# Altium project AirGunBoard.PrjPcb
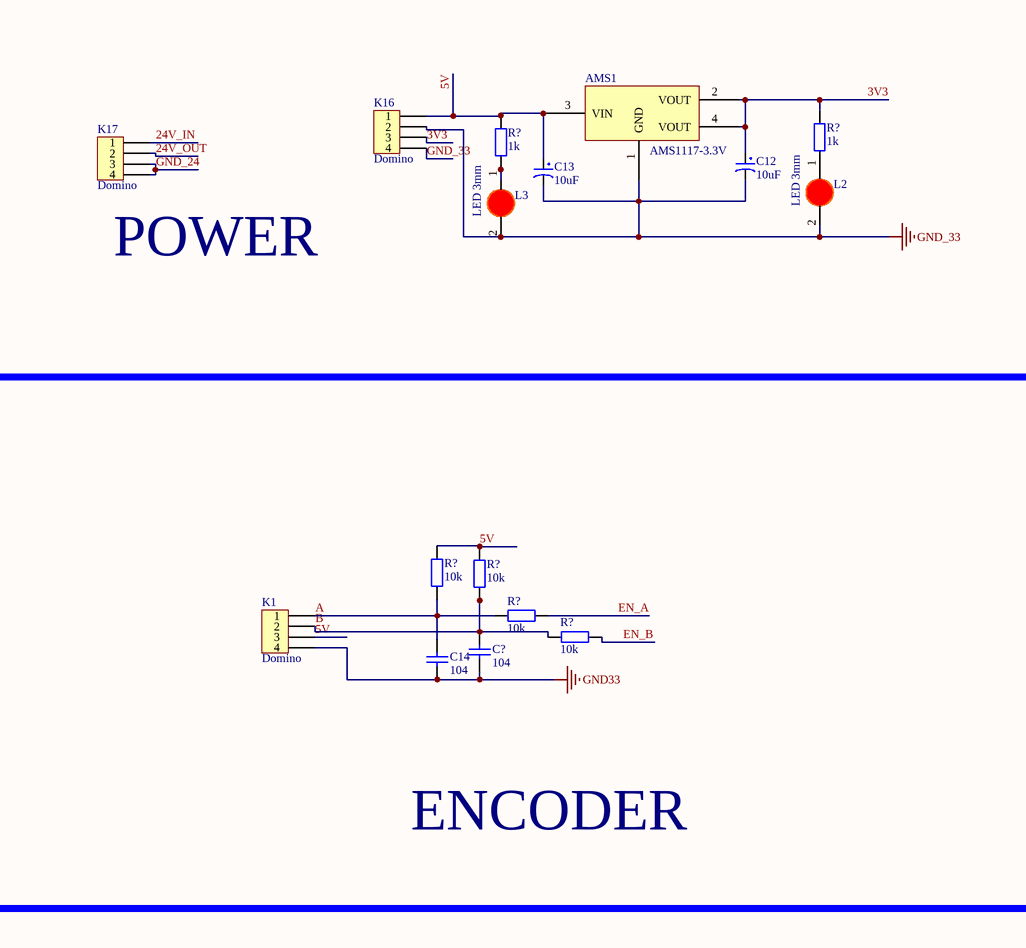
[diagram p0: board.SchDoc, top left]
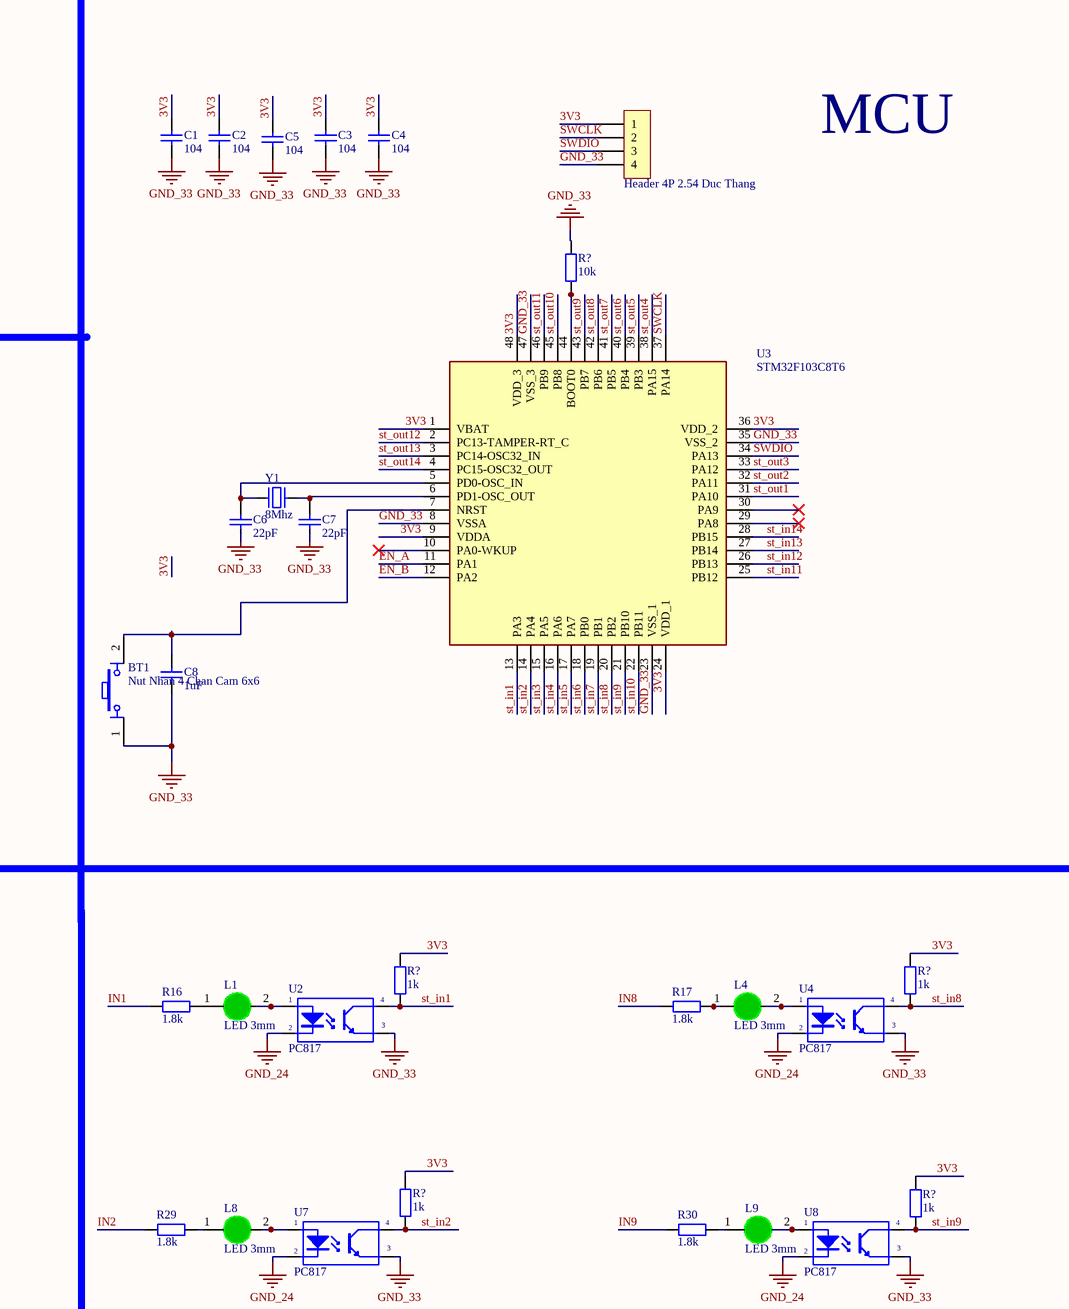
[diagram p1: board.SchDoc, top right]
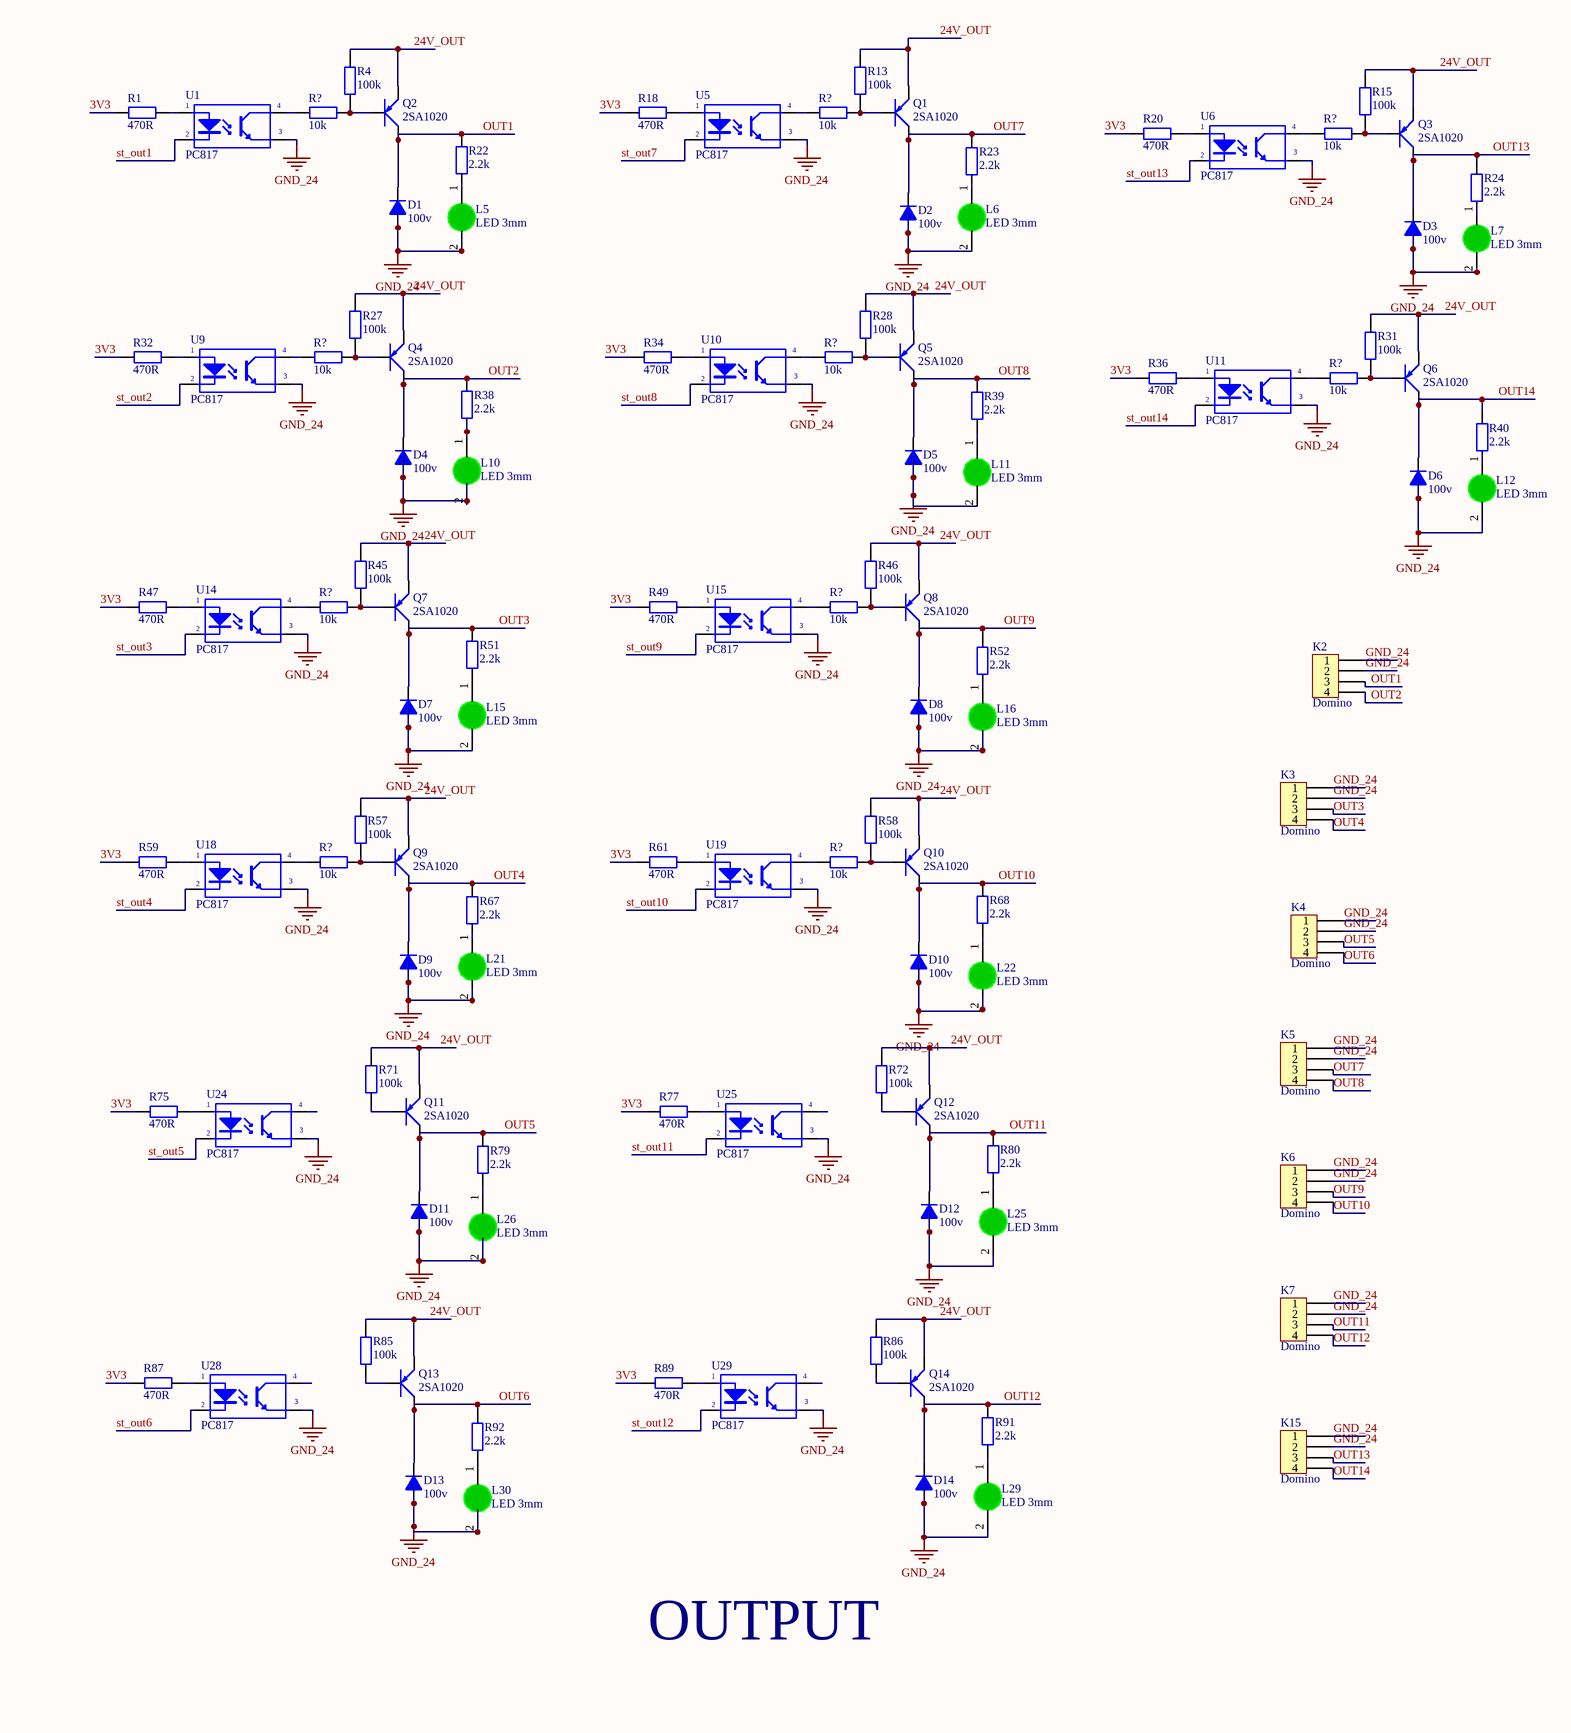
[diagram p2: board.SchDoc, bottom left]
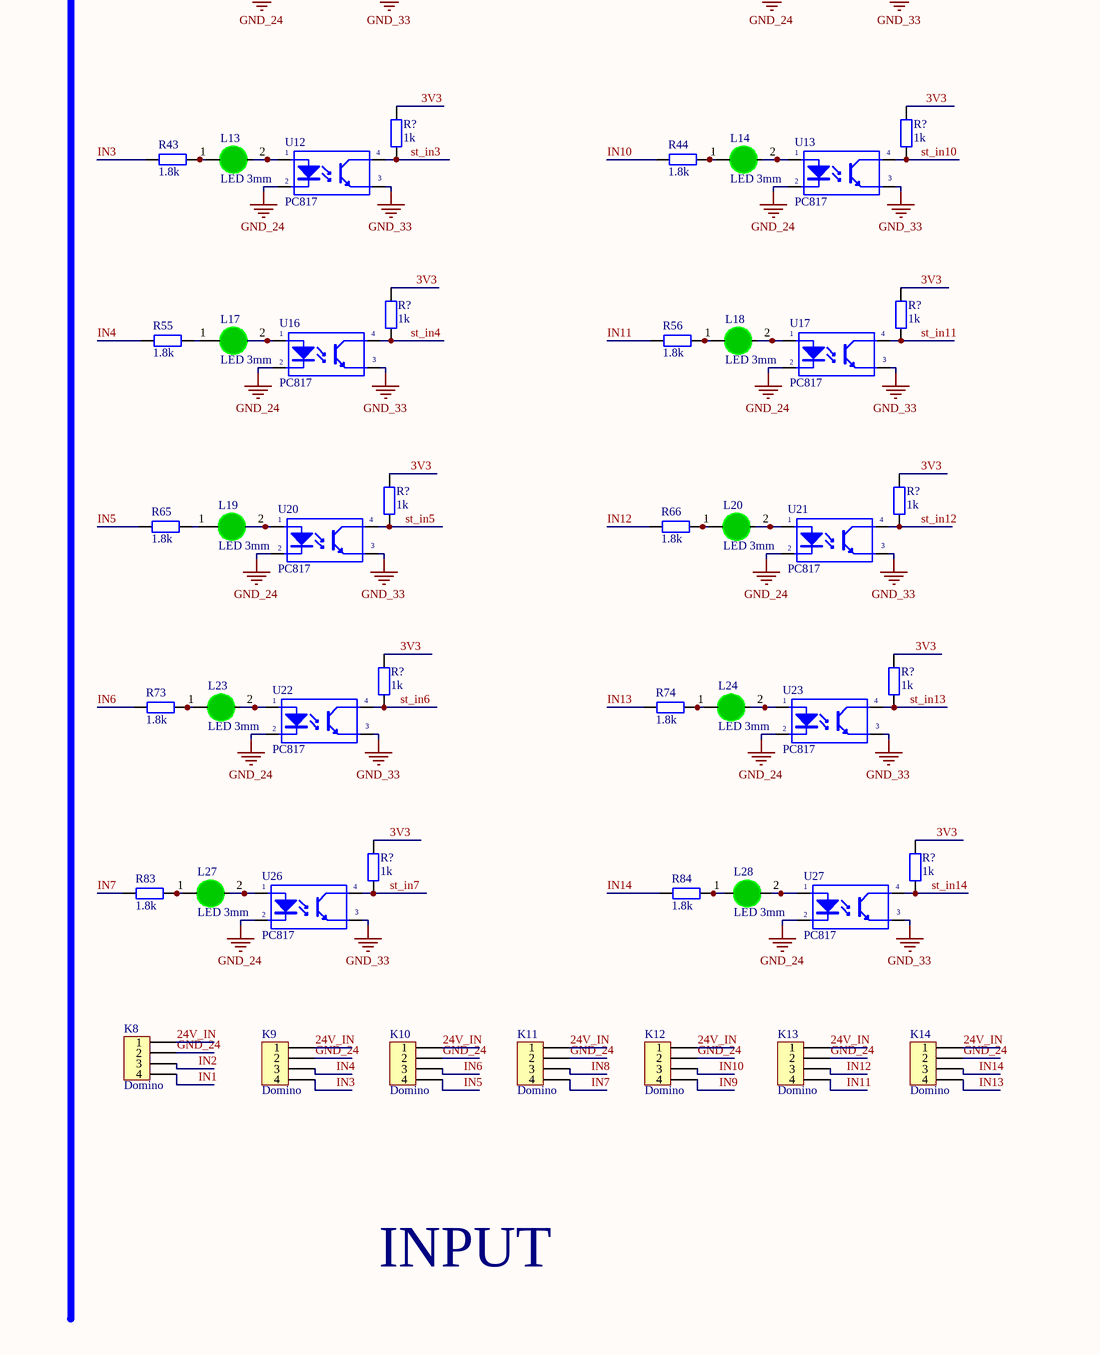
[diagram p3: board.SchDoc, bottom right]
1 sheet, 207 parts. Net scope: global (net labels, ports and power ports of the same name join across sheets).
Board file: board.PcbDoc

## Sheet board.SchDoc
size 500 x 500 mm; SheetNumber: 1; SheetTotal: 1

### Parts
(Parts that share a designator on the sheet are numbered #1, #2 ... from top to bottom, then left to right.)
AMS1  AMS1117-3.3V  [SOT223]
BT1  Nut Nhan 4 Chan Cam 6x6  [Nut Nhan 4 Chan Cam 6x6]
C1  104  [tu gom]
C2  104  [tu gom]
C3  104  [tu gom]
C4  104  [tu gom]
C5  104  [tu gom]
C6  22pF  [tu gom]
C7  22pF  [tu gom]
C8  1uF  [tu tantalum dip5.08]
C12  10uF  [tu hoa 4mm]
C13  10uF  [tu hoa 4mm]
C14  104  [tu gom]
C?  104  [tu 1206]
D1  100v  [DIODE 1A]
D2  100v  [DIODE 1A]
D3  100v  [DIODE 1A]
D4  100v  [DIODE 1A]
D5  100v  [DIODE 1A]
D6  100v  [DIODE 1A]
D7  100v  [DIODE 1A]
D8  100v  [DIODE 1A]
D9  100v  [DIODE 1A]
D10  100v  [DIODE 1A]
D11  100v  [DIODE 1A]
D12  100v  [DIODE 1A]
D13  100v  [DIODE 1A]
D14  100v  [DIODE 1A]
H1  Header 4P 2.54 Duc Thang  [XH2.54M-4]
K1  Domino  [KF128HL_2P]
K2  Domino  [KF128HL_2P]
K3  Domino  [KF128HL_2P]
K4  Domino  [KF128HL_2P]
K5  Domino  [KF128HL_2P]
K6  Domino  [KF128HL_2P]
K7  Domino  [KF128HL_2P]
K8  Domino  [KF128HL_2P]
K9  Domino  [KF128HL_2P]
K10  Domino  [KF128HL_2P]
K11  Domino  [KF128HL_2P]
K12  Domino  [KF128HL_2P]
K13  Domino  [KF128HL_2P]
K14  Domino  [KF128HL_2P]
K15  Domino  [KF128HL_2P]
K16  Domino  [KF128HL_2P]
K17  Domino  [KF128HL_2P]
L1  LED 3mm  [LED-3MM-GREEN]
L2  LED 3mm  [LED-3MM-RED]
L3  LED 3mm  [LED-3MM-RED]
L4  LED 3mm  [LED-3MM-GREEN]
L5  LED 3mm  [LED-3MM-GREEN]
L6  LED 3mm  [LED-3MM-GREEN]
L7  LED 3mm  [LED-3MM-GREEN]
L8  LED 3mm  [LED-3MM-GREEN]
L9  LED 3mm  [LED-3MM-GREEN]
L10  LED 3mm  [LED-3MM-GREEN]
L11  LED 3mm  [LED-3MM-GREEN]
L12  LED 3mm  [LED-3MM-GREEN]
L13  LED 3mm  [LED-3MM-GREEN]
L14  LED 3mm  [LED-3MM-GREEN]
L15  LED 3mm  [LED-3MM-GREEN]
L16  LED 3mm  [LED-3MM-GREEN]
L17  LED 3mm  [LED-3MM-GREEN]
L18  LED 3mm  [LED-3MM-GREEN]
L19  LED 3mm  [LED-3MM-GREEN]
L20  LED 3mm  [LED-3MM-GREEN]
L21  LED 3mm  [LED-3MM-GREEN]
L22  LED 3mm  [LED-3MM-GREEN]
L23  LED 3mm  [LED-3MM-GREEN]
L24  LED 3mm  [LED-3MM-GREEN]
L25  LED 3mm  [LED-3MM-GREEN]
L26  LED 3mm  [LED-3MM-GREEN]
L27  LED 3mm  [LED-3MM-GREEN]
L28  LED 3mm  [LED-3MM-GREEN]
L29  LED 3mm  [LED-3MM-GREEN]
L30  LED 3mm  [LED-3MM-GREEN]
Q1  2SA1020  [TO92-123]
Q2  2SA1020  [TO92-123]
Q3  2SA1020  [TO92-123]
Q4  2SA1020  [TO92-123]
Q5  2SA1020  [TO92-123]
Q6  2SA1020  [TO92-123]
Q7  2SA1020  [TO92-123]
Q8  2SA1020  [TO92-123]
Q9  2SA1020  [TO92-123]
Q10  2SA1020  [TO92-123]
Q11  2SA1020  [TO92-123]
Q12  2SA1020  [TO92-123]
Q13  2SA1020  [TO92-123]
Q14  2SA1020  [TO92-123]
R1  470R  [tro vach 1/4w]
R4  100k  [tro vach 1/4w]
R13  100k  [tro vach 1/4w]
R15  100k  [tro vach 1/4w]
R16  1.8k  [tro vach 1/4w]
R17  1.8k  [tro vach 1/4w]
R18  470R  [tro vach 1/4w]
R20  470R  [tro vach 1/4w]
R22  2.2k  [tro vach 1/4w]
R23  2.2k  [tro vach 1/4w]
R24  2.2k  [tro vach 1/4w]
R27  100k  [tro vach 1/4w]
R28  100k  [tro vach 1/4w]
R29  1.8k  [tro vach 1/4w]
R30  1.8k  [tro vach 1/4w]
R31  100k  [tro vach 1/4w]
R32  470R  [tro vach 1/4w]
R34  470R  [tro vach 1/4w]
R36  470R  [tro vach 1/4w]
R38  2.2k  [tro vach 1/4w]
R39  2.2k  [tro vach 1/4w]
R40  2.2k  [tro vach 1/4w]
R43  1.8k  [tro vach 1/4w]
R44  1.8k  [tro vach 1/4w]
R45  100k  [tro vach 1/4w]
R46  100k  [tro vach 1/4w]
R47  470R  [tro vach 1/4w]
R49  470R  [tro vach 1/4w]
R51  2.2k  [tro vach 1/4w]
R52  2.2k  [tro vach 1/4w]
R55  1.8k  [tro vach 1/4w]
R56  1.8k  [tro vach 1/4w]
R57  100k  [tro vach 1/4w]
R58  100k  [tro vach 1/4w]
R59  470R  [tro vach 1/4w]
R61  470R  [tro vach 1/4w]
R65  1.8k  [tro vach 1/4w]
R66  1.8k  [tro vach 1/4w]
R67  2.2k  [tro vach 1/4w]
R68  2.2k  [tro vach 1/4w]
R71  100k  [tro vach 1/4w]
R72  100k  [tro vach 1/4w]
R73  1.8k  [tro vach 1/4w]
R74  1.8k  [tro vach 1/4w]
R75  470R  [tro vach 1/4w]
R77  470R  [tro vach 1/4w]
R79  2.2k  [tro vach 1/4w]
R80  2.2k  [tro vach 1/4w]
R83  1.8k  [tro vach 1/4w]
R84  1.8k  [tro vach 1/4w]
R85  100k  [tro vach 1/4w]
R86  100k  [tro vach 1/4w]
R87  470R  [tro vach 1/4w]
R89  470R  [tro vach 1/4w]
R91  2.2k  [tro vach 1/4w]
R92  2.2k  [tro vach 1/4w]
R?#1  1k  [tro smd 1206]
R?#2  1k  [tro smd 1206]
R?#3  10k  [tro smd 1206]
R?#4  10k  [tro smd 1206]
R?#5  10k  [tro smd 1206]
R?#6  10k  [tro smd 1206]
R?#7  10k  [tro smd 1206]
R?#8  1k  [tro smd 1206]
R?#9  1k  [tro smd 1206]
R?#10  10k  [tro smd 1206]
R?#11  10k  [tro smd 1206]
R?#12  10k  [tro smd 1206]
R?#13  1k  [tro smd 1206]
R?#14  1k  [tro smd 1206]
R?#15  10k  [tro smd 1206]
R?#16  10k  [tro smd 1206]
R?#17  10k  [tro smd 1206]
R?#18  1k  [tro smd 1206]
R?#19  1k  [tro smd 1206]
R?#20  10k  [tro smd 1206]
R?#21  10k  [tro smd 1206]
R?#22  1k  [tro smd 1206]
R?#23  1k  [tro smd 1206]
R?#24  10k  [tro smd 1206]
R?#25  10k  [tro smd 1206]
R?#26  1k  [tro smd 1206]
R?#27  1k  [tro smd 1206]
R?#28  1k  [tro smd 1206]
R?#29  1k  [tro smd 1206]
R?#30  1k  [tro smd 1206]
R?#31  1k  [tro smd 1206]
U1  PC817  [DIP4]
U2  PC817  [DIP4]
U3  STM32F103C8T6  [LQFP-48_19.6_393_58X11_SMD]
U4  PC817  [DIP4]
U5  PC817  [DIP4]
U6  PC817  [DIP4]
U7  PC817  [DIP4]
U8  PC817  [DIP4]
U9  PC817  [DIP4]
U10  PC817  [DIP4]
U11  PC817  [DIP4]
U12  PC817  [DIP4]
U13  PC817  [DIP4]
U14  PC817  [DIP4]
U15  PC817  [DIP4]
U16  PC817  [DIP4]
U17  PC817  [DIP4]
U18  PC817  [DIP4]
U19  PC817  [DIP4]
U20  PC817  [DIP4]
U21  PC817  [DIP4]
U22  PC817  [DIP4]
U23  PC817  [DIP4]
U24  PC817  [DIP4]
U25  PC817  [DIP4]
U26  PC817  [DIP4]
U27  PC817  [DIP4]
U28  PC817  [DIP4]
U29  PC817  [DIP4]
Y1  8Mhz  [Thach Anh 2 chan cam]

### Nets
GND33: C14.2 C?.2 K1.4
GND_24: D1.1(A) D2.1(A) D3.1(A) D4.1(A) D5.1(A) D6.1(A) D7.1(A) D8.1(A) D9.1(A) D10.1(A) D11.1(A) D12.1(A) D13.1(A) D14.1(A) K2.1 K2.2 K3.1 K3.2 K4.1 K4.2 K5.1 K5.2 K6.1 K6.2 K7.1 K7.2 K8.2 K9.2 K10.2 K11.2 K12.2 K13.2 K14.2 K15.1 K15.2 K17.3 K17.4 L5.2(K) L6.2(K) L7.2(K) L10.2(K) L11.2(K) L12.2(K) L15.2(K) L16.2(K) L21.2(K) L22.2(K) L25.2(K) L26.2(K) L29.2(K) L30.2(K) U1.3(E) U2.2(K) U4.2(K) U5.3(E) U6.3(E) U7.2(K) U8.2(K) U9.3(E) U10.3(E) U11.3(E) U12.2(K) U13.2(K) U14.3(E) U15.3(E) U16.2(K) U17.2(K) U18.3(E) U19.3(E) U20.2(K) U21.2(K) U22.2(K) U23.2(K) U24.3(E) U25.3(E) U26.2(K) U27.2(K) U28.3(E) U29.3(E)
GND_33: AMS1.1(GND) BT1.1 C1.2 C2.2 C3.2 C4.2 C5.2 C6.2 C7.2 C8.2 C12.2 C13.2 H1.4 K16.2 K16.4 L2.2(K) L3.2(K) R?#3.2 U2.3(E) U3.8(VSSA) U3.23(VSS_1) U3.35(VSS_2) U3.47(VSS_3) U4.3(E) U7.3(E) U8.3(E) U12.3(E) U13.3(E) U16.3(E) U17.3(E) U20.3(E) U21.3(E) U22.3(E) U23.3(E) U26.3(E) U27.3(E)
3V3: AMS1.2(VOUT) AMS1.4(VOUT) C1.1 C2.1 C3.1 C4.1 C5.1 C12.1 H1.1 K16.3 R1.1 R18.1 R20.1 R32.1 R34.1 R36.1 R47.1 R49.1 R59.1 R61.1 R75.1 R77.1 R87.1 R89.1 R?#1.2 R?#8.2 R?#9.2 R?#13.2 R?#14.2 R?#18.2 R?#19.2 R?#22.2 R?#23.2 R?#26.2 R?#27.2 R?#28.2 R?#29.2 R?#30.2 R?#31.2 U3.1(VBAT) U3.9(VDDA) U3.24(VDD_1) U3.36(VDD_2) U3.48(VDD_3)
5V: AMS1.3(VIN) C13.1 K1.3 K16.1 R?#2.2 R?#4.2 R?#5.2
24V_IN: K8.1 K9.1 K10.1 K11.1 K12.1 K13.1 K14.1 K17.1
24V_OUT: K17.2 Q1.1(E) Q2.1(E) Q3.1(E) Q4.1(E) Q5.1(E) Q6.1(E) Q7.1(E) Q8.1(E) Q9.1(E) Q10.1(E) Q11.1(E) Q12.1(E) Q13.1(E) Q14.1(E) R4.2 R13.2 R15.2 R27.2 R28.2 R31.2 R45.2 R46.2 R57.2 R58.2 R71.2 R72.2 R85.2 R86.2
A: C14.1 K1.1 R?#4.1 R?#6.2
B: C?.1 K1.2 R?#5.1 R?#7.2
EN_A: R?#6.1 U3.11(PA1)
EN_B: R?#7.1 U3.12(PA2)
IN1: K8.4 R16.1
IN2: K8.3 R29.1
IN3: K9.4 R43.1
IN4: K9.3 R55.1
IN5: K10.4 R65.1
IN6: K10.3 R73.1
IN7: K11.4 R83.1
IN8: K11.3 R17.1
IN9: K12.4 R30.1
IN10: K12.3 R44.1
IN11: K13.4 R56.1
IN12: K13.3 R66.1
IN13: K14.4 R74.1
IN14: K14.3 R84.1
OUT1: D1.2(K) K2.3 Q2.2(C) R22.2
OUT2: D4.2(K) K2.4 Q4.2(C) R38.2
OUT3: D7.2(K) K3.3 Q7.2(C) R51.2
OUT4: D9.2(K) K3.4 Q9.2(C) R67.2
OUT5: D11.2(K) K4.3 Q11.2(C) R79.2
OUT6: D13.2(K) K4.4 Q13.2(C) R92.2
OUT7: D2.2(K) K5.3 Q1.2(C) R23.2
OUT8: D5.2(K) K5.4 Q5.2(C) R39.2
OUT9: D8.2(K) K6.3 Q8.2(C) R52.2
OUT10: D10.2(K) K6.4 Q10.2(C) R68.2
OUT11: D12.2(K) K7.3 Q12.2(C) R80.2
OUT12: D14.2(K) K7.4 Q14.2(C) R91.2
OUT13: D3.2(K) K15.3 Q3.2(C) R24.2
OUT14: D6.2(K) K15.4 Q6.2(C) R40.2
st_in1: R?#8.1 U2.4(C) U3.13(PA3)
st_in2: R?#13.1 U3.14(PA4) U7.4(C)
st_in3: R?#18.1 U3.15(PA5) U12.4(C)
st_in4: R?#22.1 U3.16(PA6) U16.4(C)
st_in5: R?#26.1 U3.17(PA7) U20.4(C)
st_in6: R?#28.1 U3.18(PB0) U22.4(C)
st_in7: R?#30.1 U3.19(PB1) U26.4(C)
st_in8: R?#9.1 U3.20(PB2) U4.4(C)
st_in9: R?#14.1 U3.21(PB10) U8.4(C)
st_in10: R?#19.1 U3.22(PB11) U13.4(C)
st_in11: R?#23.1 U3.25(PB12) U17.4(C)
st_in12: R?#27.1 U3.26(PB13) U21.4(C)
st_in13: R?#29.1 U3.27(PB14) U23.4(C)
st_in14: R?#31.1 U3.28(PB15) U27.4(C)
st_out1: U1.2(K) U3.31(PA10)
st_out2: U3.32(PA11) U9.2(K)
st_out3: U3.33(PA12) U14.2(K)
st_out4: U3.38(PA15) U18.2(K)
st_out5: U3.39(PB3) U24.2(K)
st_out6: U3.40(PB4) U28.2(K)
st_out7: U3.41(PB5) U5.2(K)
st_out8: U3.42(PB6) U10.2(K)
st_out9: U3.43(PB7) U15.2(K)
st_out10: U3.45(PB8) U19.2(K)
st_out11: U3.46(PB9) U25.2(K)
st_out12: U3.2(PC13-TAMPER-RT_C) U29.2(K)
st_out13: U3.3(PC14-OSC32_IN) U6.2(K)
st_out14: U3.4(PC15-OSC32_OUT) U11.2(K)
SWCLK: H1.2 U3.37(PA14)
SWDIO: H1.3 U3.34(PA13)
NetBT1_2: BT1.2 C8.1 U3.7(NRST)
NetC6_1: C6.1 U3.5(PD0-OSC_IN) Y1.2
NetC7_1: C7.1 U3.6(PD1-OSC_OUT) Y1.1
NetL1_1: L1.1(A) R16.2
NetL1_2: L1.2(K) U2.1(A)
NetL3_1: L3.1(A) R?#2.1
NetL4_1: L4.1(A) R17.2
NetL4_2: L4.2(K) U4.1(A)
NetL5_1: L5.1(A) R22.1
NetL6_1: L6.1(A) R23.1
NetL7_1: L7.1(A) R24.1
NetL8_1: L8.1(A) R29.2
NetL8_2: L8.2(K) U7.1(A)
NetL9_1: L9.1(A) R30.2
NetL9_2: L9.2(K) U8.1(A)
NetL10_1: L10.1(A) R38.1
NetL11_1: L11.1(A) R39.1
NetL12_1: L12.1(A) R40.1
NetL13_1: L13.1(A) R43.2
NetL13_2: L13.2(K) U12.1(A)
NetL14_1: L14.1(A) R44.2
NetL14_2: L14.2(K) U13.1(A)
NetL15_1: L15.1(A) R51.1
NetL16_1: L16.1(A) R52.1
NetL17_1: L17.1(A) R55.2
NetL17_2: L17.2(K) U16.1(A)
NetL18_1: L18.1(A) R56.2
NetL18_2: L18.2(K) U17.1(A)
NetL19_1: L19.1(A) R65.2
NetL19_2: L19.2(K) U20.1(A)
NetL20_1: L20.1(A) R66.2
NetL20_2: L20.2(K) U21.1(A)
NetL21_1: L21.1(A) R67.1
NetL22_1: L22.1(A) R68.1
NetL23_1: L23.1(A) R73.2
NetL23_2: L23.2(K) U22.1(A)
NetL24_1: L24.1(A) R74.2
NetL24_2: L24.2(K) U23.1(A)
NetL25_1: L25.1(A) R80.1
NetL26_1: L26.1(A) R79.1
NetL27_1: L27.1(A) R83.2
NetL27_2: L27.2(K) U26.1(A)
NetL28_1: L28.1(A) R84.2
NetL28_2: L28.2(K) U27.1(A)
NetL29_1: L29.1(A) R91.1
NetL30_1: L30.1(A) R92.1
NetQ1_3: Q1.3(B) R13.1 R?#11.1
NetQ2_3: Q2.3(B) R4.1 R?#10.1
NetQ3_3: Q3.3(B) R15.1 R?#12.1
NetQ4_3: Q4.3(B) R27.1 R?#15.1
NetQ5_3: Q5.3(B) R28.1 R?#16.1
NetQ6_3: Q6.3(B) R31.1 R?#17.1
NetQ7_3: Q7.3(B) R45.1 R?#20.1
NetQ8_3: Q8.3(B) R46.1 R?#21.1
NetQ9_3: Q9.3(B) R57.1 R?#24.1
NetQ10_3: Q10.3(B) R58.1 R?#25.1
NetQ11_3: Q11.3(B) R71.1
NetQ12_3: Q12.3(B) R72.1
NetQ13_3: Q13.3(B) R85.1
NetQ14_3: Q14.3(B) R86.1
NetR1_2: R1.2 U1.1(A)
NetR18_2: R18.2 U5.1(A)
NetR20_2: R20.2 U6.1(A)
NetR32_2: R32.2 U9.1(A)
NetR34_2: R34.2 U10.1(A)
NetR36_2: R36.2 U11.1(A)
NetR47_2: R47.2 U14.1(A)
NetR49_2: R49.2 U15.1(A)
NetR59_2: R59.2 U18.1(A)
NetR61_2: R61.2 U19.1(A)
NetR75_2: R75.2 U24.1(A)
NetR77_2: R77.2 U25.1(A)
NetR87_2: R87.2 U28.1(A)
NetR89_2: R89.2 U29.1(A)
NetR?#3_1: R?#3.1 U3.44(BOOT0)
NetR?#10_2: R?#10.2 U1.4(C)
NetR?#11_2: R?#11.2 U5.4(C)
NetR?#12_2: R?#12.2 U6.4(C)
NetR?#15_2: R?#15.2 U9.4(C)
NetR?#16_2: R?#16.2 U10.4(C)
NetR?#17_2: R?#17.2 U11.4(C)
NetR?#20_2: R?#20.2 U14.4(C)
NetR?#21_2: R?#21.2 U15.4(C)
NetR?#24_2: R?#24.2 U18.4(C)
NetR?#25_2: R?#25.2 U19.4(C)

Not connected (* = marked no-connect by the designer): L2 1(A); R?#1 1; U3 10(PA0-WKUP)* 29(PA8)* 30(PA9)*; U24 4(C); U25 4(C); U28 4(C); U29 4(C)

### Notes on the sheet
- MCU
- (near K17) POWER
- ENCODER
- OUTPUT
- INPUT

### Library data of the parts
AMS1 = AMS1117 SMD: Dán; Value: AMS1117-3.3V SOT223; Don_Vi: Con; Ma_Hang: MH000596; Ghi_Chu: *; Kieu_Chan: *; Chung_Loai: Dán
BT1 = Nut Nhan 4 Chan Cam 6x6: Nut Nhan 4 Chan 6x6mm; Ten: Nút Nhấn 4 Chân 6x6x5MM DIP; Ma_Hang: MH004584
C1-C5 C14 = Tu gom 104 50V: Cắm; So_Chan: 2; Ten_Linh_Kien: Tụ gốm 104 100nF 50V; Don_Vi: Con; Ma_Hang: MH004761; Chung_Loai: Cắm; Kieu_Chan: *
C6 C7 = Tu gom 22pF 50V: Cắm; Don_Vi: Con; So_Chan: 2; Ten_Linh_Kien: Tụ gốm 22P 50V; Ma_Hang: MH004771; Chung_Loai: Cắm; Kieu_Chan: *
C8 = Tu tantalum 1uF DIP5.08: Cắm; Don_Vi: Con; So_Chan: 2; Ten_Linh_Kien: Tụ tantalum 105-1uF DIP5.08 sứ vàng; Ma_Hang: MH007470; Chung_Loai: Cắm; Kieu_Chan: *
C12 C13 = Tu Hoa 10uF 25V 4x7: Cắm; So_Chan: 2; Ten_Linh_Kien: Tụ Hóa 10uF 25V 4x7MM; Don_Vi: Con; Ma_Hang: MH001349; Chung_Loai: Cắm; Kieu_Chan: *
C? = Tu 1206 104 50V 20%: Dán; Don_Vi: Con; So_Chan: 2; Ten_Linh_Kien: Tụ 1206 104-0.1uF 20% 50V; Ma_Hang: MH004544; Chung_Loai: Dán; Kieu_Chan: *
D1-D14 = Diode 1N4007: Cắm; Ten_Linh_Kien: Diode 1N4007 1A (DIP); Don_Vi: Con; Ma_Hang: MH001063; Ghi Chu: *; Kieu_Chan: *; Chung_Loai: Cắm
H1 = Header 4P 2.54 Duc Thang: Cắm; Ten_Linh_Kien: Header 4P XH2.54-4P Đực Thẳng; Don_Vi: Con; Ma_Hang: MH001285; Chung_Loai: Cắm
K1-K17 = KF128HL_2P
L1 L4-L30 = LED 3mm Xanh La: Cắm; Don_Vi: Con; Ma_Hang: MH001054; Ten_Linh_Kien: Led 3MM Phủ Xanh (10c); Ghi_Chu: *; Kieu_Chan: *; Chung_Loai: Cắm
L2 L3 = LED 3mm Do: Cắm; Don_Vi: Con; Ma_Hang: MH003892; Ten_Linh_Kien: Led 3MM Phủ Đỏ (10c); Ghi_Chu: *; Kieu_Chan: *; Chung_Loai: Cắm
Q1-Q14 = 2SA1015: PNP 600mW, ECB; Value: A1015
R1 R18 R20 R32 R34 R36 R47 R49 R59 R61 R75 R77 R87 R89 = Tro Vach 1/4W 5% 470R: Cắm; Don_Vi: Con; So_Chan: 2; Ten_Linh_Kien: Trở Vạch 1/4w 5% 470R; Ma_Hang: MH007320; Chung_Loai: Cắm; Kieu_Chan: *
R4 R13 R15 R27 R28 R31 R45 R46 R57 R58 R71 R72 R85 R86 = Tro Vach 1/4W 5% 100k: Cắm; Don_Vi: Con; So_Chan: 2; Ten_Linh_Kien: Trở Vạch 1/4w 5% 100k; Ma_Hang: MH007352; Chung_Loai: Cắm; Kieu_Chan: *
R16 R17 R29 R30 R43 R44 R55 R56 R65 R66 R73 R74 R83 R84 = Tro Vach 1/4W 5% 1.8k: Cắm; Don_Vi: Con; So_Chan: 2; Ten_Linh_Kien: Trở Vạch 1/4w 5% 1.8k; Ma_Hang: MH007285; Chung_Loai: Cắm; Kieu_Chan: *
R22-R24 R38-R40 R51 R52 R67 R68 R79 R80 R91 R92 = Tro Vach 1/4W 5% 2.2k: Cắm; Don_Vi: Con; So_Chan: 2; Ten_Linh_Kien: Trở Vạch 1/4w 5% 2.2k; Ma_Hang: MH007293; Chung_Loai: Cắm; Kieu_Chan: *
R?#1 R?#2 R?#8 R?#9 R?#13 R?#14 R?#18 R?#19 R?#22 R?#23 R?#26-R?#31 = Tro 1206 5% 1k: Dán; Don_Vi: Con; So_Chan: 2; Ten_Linh_Kien: Trở 1206 5% 1k; Ma_Hang: MH005904; Chung_Loai: Dán; Kieu_Chan: *
R?#3-R?#7 R?#10-R?#12 R?#15-R?#17 R?#20 R?#21 R?#24 R?#25 = Tro 1206 5% 10k: Dán; Don_Vi: Con; So_Chan: 2; Ten_Linh_Kien: Trở 1206 5% 10K; Ma_Hang: MH005909; Chung_Loai: Dán; Kieu_Chan: *
U1 U2 U4-U29 = PC817: Single Opto; Value: PC817
U3 = IC_STM32F103C8T6: ARM® Cortex®-M3 STM32F1 Microcontroller IC 32-Bit 72MHz 64KB (64K x 8) FLASH 48-LQFP (7x7) /; Manufacturer: STMicroelectronics; Alternate Part Number-1: NA; Manufacturer Part Number: STM32F103C8T6; Case/Package: LQFP48; Supplier-1: LCSC; Supplier Part Number-1: STM32F103C8T6
Y1 = Thach Anh 2 chan Cam: Crystal For all Crystal 2pin.; Value: 4Mhz